# EAGLE design Lasermodul (EAGLE 7.3.0)
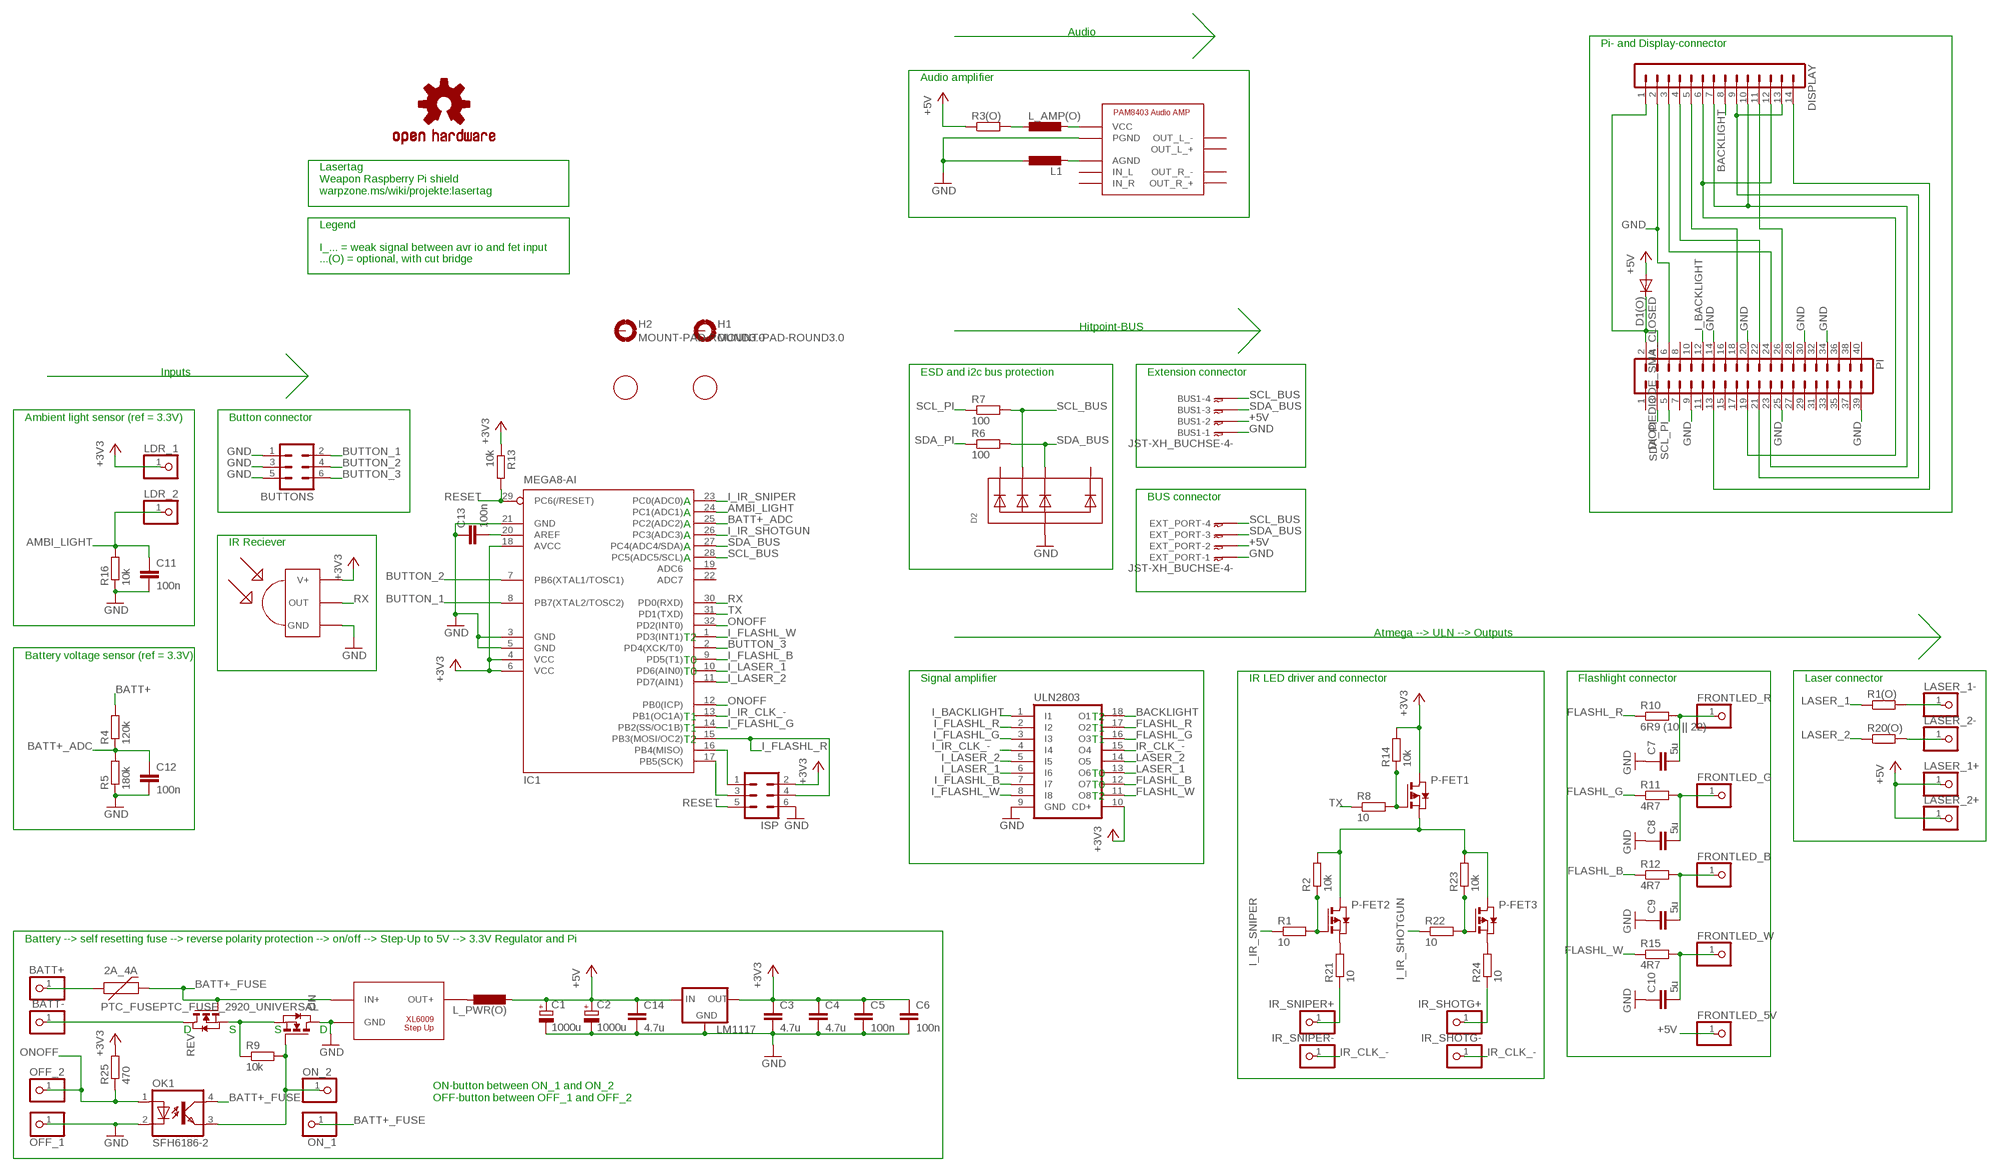
[diagram p0: schematic, sheet 1]

## Parts
2A_4A  PTC_FUSEPTC_FUSE_2920_UNIVERSAL  [PTC_FUSE_2920_UNIVERSAL]
BATT+  PIN-HEADER-1PIN-HEADER-1_BIG  [PIN-HEADER-1_BIG]
BATT-  PIN-HEADER-1PIN-HEADER-1_BIG  [PIN-HEADER-1_BIG]
BUS1  JST-XH_BUCHSE-4-  [JST-XH_BUCHSE-4]
BUTTONS  PIN-HEADER-3X2  [PIN-HEADER-3X2]
C1  1000u  C_EU_POL  [C_UNIVERSAL_PAD]
C2  1000u  C_EU_POL  [C_UNIVERSAL_PAD]
C3  4.7u  C_EU0805  [0805]
C4  4.7u  C_EU0805  [0805]
C5  100n  C_EU0603  [0603]
C6  100n  C_EU0603  [0603]
C7  5u  C_EU0805  [0805]
C8  5u  C_EU0805  [0805]
C9  5u  C_EU0805  [0805]
C10  5u  C_EU0805  [0805]
C11  100n  C_EU0603  [0603]
C12  100n  C_EU0603  [0603]
C13  100n  C_EU0603  [0603]
C14  4.7u  C_EU0805  [0805]
D1(O)  DIODEDIODE_SMA_CLOSED  [DIODE_SMA_CLOSED]
D2  ESD-SCHUTZ  [SOT363]
DISPLAY  PIN-HEADER-DISPLAY  [PIN-HEADER-DISPLAY]
EXT_PORT  JST-XH_BUCHSE-4-  [JST-XH_BUCHSE-4]
FRONTLED_5V  PIN-HEADER-1PIN-HEADER-1  [PIN-HEADER-1]
FRONTLED_B  PIN-HEADER-1PIN-HEADER-1  [PIN-HEADER-1]
FRONTLED_G  PIN-HEADER-1PIN-HEADER-1  [PIN-HEADER-1]
FRONTLED_R  PIN-HEADER-1PIN-HEADER-1  [PIN-HEADER-1]
FRONTLED_W  PIN-HEADER-1PIN-HEADER-1  [PIN-HEADER-1]
H1  MOUNT-PAD-ROUND3.0  [3,0-PAD]
H2  MOUNT-PAD-ROUND3.0  [3,0-PAD]
IC1  MEGA8-AI  [TQFP32-08]
IR_SHOTG+  PIN-HEADER-1PIN-HEADER-1  [PIN-HEADER-1]
IR_SHOTG-  PIN-HEADER-1PIN-HEADER-1  [PIN-HEADER-1]
IR_SNIPER+  PIN-HEADER-1PIN-HEADER-1  [PIN-HEADER-1]
IR_SNIPER-  PIN-HEADER-1PIN-HEADER-1  [PIN-HEADER-1]
ISP  PIN-HEADER-3X2  [PIN-HEADER-3X2]
L1  L-EUL2825P  [L2825P]
L_AMP(O)  L  [L_5MM_CLOSED]
L_PWR(O)  L  [L_5MM_CLOSED]
LASER_1+  PIN-HEADER-1PIN-HEADER-1  [PIN-HEADER-1]
LASER_1-  PIN-HEADER-1PIN-HEADER-1  [PIN-HEADER-1]
LASER_2+  PIN-HEADER-1PIN-HEADER-1  [PIN-HEADER-1]
LASER_2-  PIN-HEADER-1PIN-HEADER-1  [PIN-HEADER-1]
LDR_1  PIN-HEADER-1PIN-HEADER-1  [PIN-HEADER-1]
LDR_2  PIN-HEADER-1PIN-HEADER-1  [PIN-HEADER-1]
LM1117  LM1117_3V3_REGULATOR  [SOT223]
LOGO1  OSHW-LOGOM  [OSHW-LOGO-M]
OFF_1  PIN-HEADER-1PIN-HEADER-1  [PIN-HEADER-1]
OFF_2  PIN-HEADER-1PIN-HEADER-1  [PIN-HEADER-1]
OK1  SFH6186-2  [SMD4-7]
ON  N-MOSFET  [TO252]
ON_1  PIN-HEADER-1PIN-HEADER-1  [PIN-HEADER-1]
ON_2  PIN-HEADER-1PIN-HEADER-1  [PIN-HEADER-1]
P-FET1  PMOSSOT23  [SOT-23]
P-FET2  PMOSSOT23  [SOT-23]
P-FET3  PMOSSOT23  [SOT-23]
PI  PIN-HEADER-20X2  [PIN-HEADER-20X2]
R1  10  R_EU0603  [0603]
R1(O)  R_EU0603_CLOSED  [0603_CLOSED]
R2  10k  R_EU0603  [0603]
R3(O)  R_EU0805_CLOSED  [0805_CLOSED]
R4  120k  R_EU0603  [0603]
R5  180k  R_EU0603  [0603]
R6  100  R_EU0603  [0603]
R7  100  R_EU0603  [0603]
R8  10  R_EU0603  [0603]
R9  10k  R_EU0603  [0603]
R10  6R9 (10 || 22)  R_EU0603  [0603]
R11  4R7  R_EU0603  [0603]
R12  4R7  R_EU0603  [0603]
R13  10k  R_EU0603  [0603]
R14  10k  R_EU0603  [0603]
R15  4R7  R_EU0603  [0603]
R16  10k  R_EU0603  [0603]
R20(O)  R_EU0603_CLOSED  [0603_CLOSED]
R21  10  R_EU0603  [0603]
R22  10  R_EU0603  [0603]
R23  10k  R_EU0603  [0603]
R24  10  R_EU0603  [0603]
R25  470  R_EU0603  [0603]
REV  N-MOSFET  [TO252]
U$1  TSOP1838  [TSOP18XX]
U$3  XL6009-STEPUP-BOARD  [XL6009-STEPUP-BOARD]
U$4  PAM8403-AMP-BOARD  [PAM8403-AMP-BOARD]
U$5  FIDUCIAL  [FIDUCIAL_1MM]
U$6  FIDUCIAL  [FIDUCIAL_1MM]
ULN2803  ULN2803ASO18  [SO18W]

## Nets
+3V3: C3.1 C4.1 C5.1 C6.1 IC1.4(VCC) IC1.6(VCC) IC1.18(AVCC) ISP.2 LDR_1.1 LM1117.2(OUT) LM1117.4(OUT) P-FET1.1(D) R13.1 R14.2 R25.2 U$1.VCC(V+) ULN2803.10(CD+)
+5V: BUS1.P$2 C1.+ C2.+ C14.1 D1(O).A EXT_PORT.P$2 FRONTLED_5V.1 L_PWR(O).2 LASER_1+.1 LASER_2+.1 LM1117.3(IN) R3(O).1
AMBI_LIGHT: C11.1 IC1.24(PC1(ADC1)) LDR_2.1 R16.2
BACKLIGHT: DISPLAY.8 ULN2803.18(O1)
BATT+: 2A_4A.P$1 BATT+.1 R4.2
BATT+_ADC: C12.1 IC1.25(PC2(ADC2)) R4.1 R5.2
BATT+_FUSE: 2A_4A.P$2 OK1.4(COL) ON_1.1 REV.1(G) U$3.IN+
BATT-: BATT-.1 REV.3(D)
BUTTON_1: BUTTONS.2 IC1.8(PB7(XTAL2/TOSC2))
BUTTON_2: BUTTONS.4 IC1.7(PB6(XTAL1/TOSC1))
BUTTON_3: BUTTONS.6 IC1.2(PD4(XCK/T0))
EASTEREGG_NET: P-FET1.2(S) P-FET2.1(D) P-FET3.1(D) R2.2 R23.2
FLASHL_B: R12.1 ULN2803.12(O7)
FLASHL_G: R11.1 ULN2803.16(O3)
FLASHL_R: R10.1 ULN2803.17(O2)
FLASHL_W: R15.1 ULN2803.11(O8)
GND: BUS1.P$1 BUTTONS.1 BUTTONS.3 BUTTONS.5 C1.- C2.- C3.2 C4.2 C5.2 C6.2 C7.1 C8.1 C9.1 C10.1 C11.2 C12.2 C13.1 C14.2 D2.2(A) DISPLAY.2 EXT_PORT.P$1 IC1.3(GND) IC1.5(GND) IC1.21(GND) ISP.6 L1.1 LM1117.1(GND) OFF_1.1 OK1.2(C) ON.3(D) PI.6 PI.9 PI.14 PI.20 PI.25 PI.30 PI.34 PI.39 R5.1 R16.1 U$1.GND U$3.GND_IN(GND) U$3.GND_OUT(GND) U$4.PGND ULN2803.9(GND)
I_BACKLIGHT: PI.12 ULN2803.1(I1)
I_FLASHL_B: IC1.9(PD5(T1)) ULN2803.7(I7)
I_FLASHL_G: IC1.14(PB2(SS/OC1B)) ULN2803.3(I3)
I_FLASHL_R: IC1.15(PB3(MOSI/OC2)) ISP.4 ULN2803.2(I2)
I_FLASHL_W: IC1.1(PD3(INT1)) ULN2803.8(I8)
I_IR_CLK_-: IC1.13(PB1(OC1A)) ULN2803.4(I4)
I_IR_SHOTGUN: IC1.26(PC3(ADC3)) R22.1
I_IR_SNIPER: IC1.23(PC0(ADC0)) R1.1
I_LASER_1: IC1.10(PD6(AIN0)) ULN2803.6(I6)
I_LASER_2: IC1.11(PD7(AIN1)) ULN2803.5(I5)
IR_CLK_-: IR_SHOTG-.1 IR_SNIPER-.1 ULN2803.15(O4)
IR_SHOTGUN_TX_+: IR_SHOTG+.1 R24.1
IR_SNIPER_TX_+: IR_SNIPER+.1 R21.1
LASER_1: R1(O).1 ULN2803.13(O6)
LASER_1-: LASER_1-.1 R1(O).2
LASER_2: R20(O).1 ULN2803.14(O5)
LASER_2-: LASER_2-.1 R20(O).2
LCD_CS: DISPLAY.3 PI.24
LCD_DC: DISPLAY.5 PI.18
LCD_MISO: DISPLAY.9 DISPLAY.13 PI.21
LCD_MOSI: DISPLAY.6 DISPLAY.12 PI.19
LCD_RESET: DISPLAY.4 PI.22
LCD_SCK: DISPLAY.7 DISPLAY.10 PI.23
LCD_TOUCH_CS: DISPLAY.11 PI.26
LCD_TOUCH_IRQ: DISPLAY.14 PI.13
N$5: L1.2 U$4.AGND
N$11: IC1.16(PB4(MISO)) ISP.1
N$13: IC1.17(PB5(SCK)) ISP.3
N$15: C7.2 FRONTLED_R.1 R10.2
N$16: P-FET1.3(G) R8.2 R14.1
N$18: C13.2 IC1.20(AREF)
N$20: P-FET2.3(G) R1.2 R2.1
N$21: C8.2 FRONTLED_G.1 R11.2
N$22: C9.2 FRONTLED_B.1 R12.2
N$23: C10.2 FRONTLED_W.1 R15.2
N$27: L_PWR(O).1 U$3.OUT+
N$28: ON.2(S) R9.1 REV.2(S)
N$34: P-FET2.2(S) R21.2
N$44: D1(O).C DISPLAY.1 PI.2 PI.4
N$45: L_AMP(O).2 R3(O).2
N$46: L_AMP(O).1 U$4.VCC
N$53: P-FET3.2(S) R24.2
N$55: P-FET3.3(G) R22.2 R23.1
ONOFF: IC1.12(PB0(ICP)) IC1.32(PD2(INT0)) OFF_2.1 OK1.1(A) R25.1
ONOFF_2: OK1.3(EMIT) ON.1(G) ON_2.1 R9.2
RESET: IC1.29(PC6(/RESET)) ISP.5 R13.2
RX: IC1.30(PD0(RXD)) U$1.OUT
SCL_BUS: BUS1.P$4 D2.3(C2) EXT_PORT.P$4 IC1.28(PC5(ADC5/SCL)) R7.2
SCL_PI: PI.5 R7.1
SDA_BUS: BUS1.P$3 D2.4(C3) EXT_PORT.P$3 IC1.27(PC4(ADC4/SDA)) R6.2
SDA_PI: PI.3 R6.1
TX: IC1.31(PD1(TXD)) R8.1
Unconnected: D2.1(C1) D2.6(C5) H1.B3,0(MOUNT) H2.B3,0(MOUNT) IC1.19(ADC6) IC1.22(ADC7) PI.1 PI.7 PI.8 PI.10 PI.11 PI.15 PI.16 PI.17 PI.27 PI.28 PI.29 PI.31 PI.32 PI.33 PI.35 PI.36 PI.37 PI.38 PI.40 U$4.IN_L U$4.IN_R U$4.OUT_L_+ U$4.OUT_L_- U$4.OUT_R_+ U$4.OUT_R_-

## Notes on the sheet
- Audio
- Pi- and Display-connector
- Audio amplifier
- Lasertag
  Weapon Raspberry Pi shield
  warpzone.ms/wiki/projekte:lasertag
- Legend
- I_... = weak signal between avr io and fet input
- ...(O) = optional, with cut bridge
- Hitpoint-BUS
- Inputs | ESD and i2c bus protection | Extension connector
- Ambient light sensor (ref = 3.3V) | Button connector
- BUS connector
- A
- A
- A
- A
- IR Reciever
- A
- A
- Atmega --> ULN --> Outputs
- T2
- Battery voltage sensor (ref = 3.3V)
- T0
- T0
- Signal amplifier | IR LED driver and connector | Flashlight connector | Laser connector
- T1 | T2
- T1 | T1
- T2 | T1
- T0
- T0
- T2
- Battery --> self resetting fuse --> reverse polarity protection --> on/off --> Step-Up to 5V --> 3.3V Regulator and Pi
- D | S | S | D
- ON-button between ON_1 and ON_2
  OFF-button between OFF_1 and OFF_2

## Library data of the parts
2A_4A = wz:PTC_FUSE: PTC Resettable Fuse
BATT+ BATT- FRONTLED_5V FRONTLED_B FRONTLED_G FRONTLED_R FRONTLED_W IR_SHOTG+ IR_SHOTG- IR_SNIPER+ IR_SNIPER- LASER_1+ LASER_1- LASER_2+ LASER_2- LDR_1 LDR_2 OFF_1 OFF_2 ON_1 ON_2 = wz:PIN-HEADER-1: PIN HEADER
BUS1 EXT_PORT = wz:JST-XH_BUCHSE-4: JST CONNECTOR
BUTTONS ISP = wz:PIN-HEADER-3X2: PIN HEADER; OC_FARNELL: unknown; OC_NEWARK: unknown
C1 C2 = wz:C_EU_POL: CAPACITOR, European symbol
C3-C14 = wz:C_EU: CAPACITOR, European symbol
D1(O) = wz:DIODE: DIODE super fast rectifier, 2 A
D2 = wz:ESD-SCHUTZ: Voltage Transient Suppressor Array SOT363 SMF05C - 100W 5V: Digikey - SMF05CT1GOSCT-ND
DISPLAY = wz:PIN-HEADER-DISPLAY: PIN HEADER; OC_FARNELL: unknown; OC_NEWARK: unknown
H1 H2 = holes:MOUNT-PAD-ROUND: MOUNTING PAD, round
IC1 = atmel:MEGA8: MICROCONTROLLER 8 Kbytes FLASH, 1 kbytes SRAM, 512 bytes EEPROM, USART, 6-channel 10 bit ADC, 2-channel 8 bit ADC Pin compatible with Atmega48, ATMega88, ATMega168 Source: avr.lbr; MPN: ATMEGA8-16AU; OC_FARNELL: 9171371; OC_NEWARK: 73M8863
L1 = rcl:L-EU: INDUCTOR, European symbol
L_AMP(O) L_PWR(O) = wz:L
LM1117 = wz:LM1117_3V3_REGULATOR: 1117
LOGO1 = SparkFun-Aesthetics:OSHW-LOGO: Open Source Hardware Logo This logo indicates the piece of hardware it is found on incorporates a OSHW license and/or adheres to the definition of open source hardware found here: http://freedomdefined.org/OSHW
OK1 = optocoupler:SFH618?*: Optocoupler, Phototransistor Output, Low Input Current Source: Data sheet <http://www.vishay.com/docs/83673/sfh618.pdf>; MF: VISHAY/TELEFUNKEN; MPN: SFH6186-2; OC_FARNELL: 1469583; OC_NEWARK: 58K2210
ON REV = wz:N-MOSFET: MOS FET
P-FET1-P-FET3 = zetex:PMOSSOT23: MOS FET; OC_FARNELL: unknown; OC_NEWARK: unknown
PI = wz:PIN-HEADER-20X2: PIN HEADER; OC_FARNELL: unknown; OC_NEWARK: unknown
R1 R1(O) R2 R3(O) R4-R16 R20(O) R21-R25 = wz:R_EU: RESISTOR, European symbol
U$1 = tsop:TSOP1838: IR Receiver and Demodulator
U$3 = wz:XL6009-STEPUP-BOARD
U$4 = wz:PAM8403-AMP-BOARD
U$5 U$6 = adafruit:FIDUCIAL: For use by pick and place machines to calibrate the vision/machine, 1mm By microbuilder.eu
ULN2803 = wz:ULN2803A: DRIVER ARRAY

## Net classes
0 default: width 0.016 mm

## Board
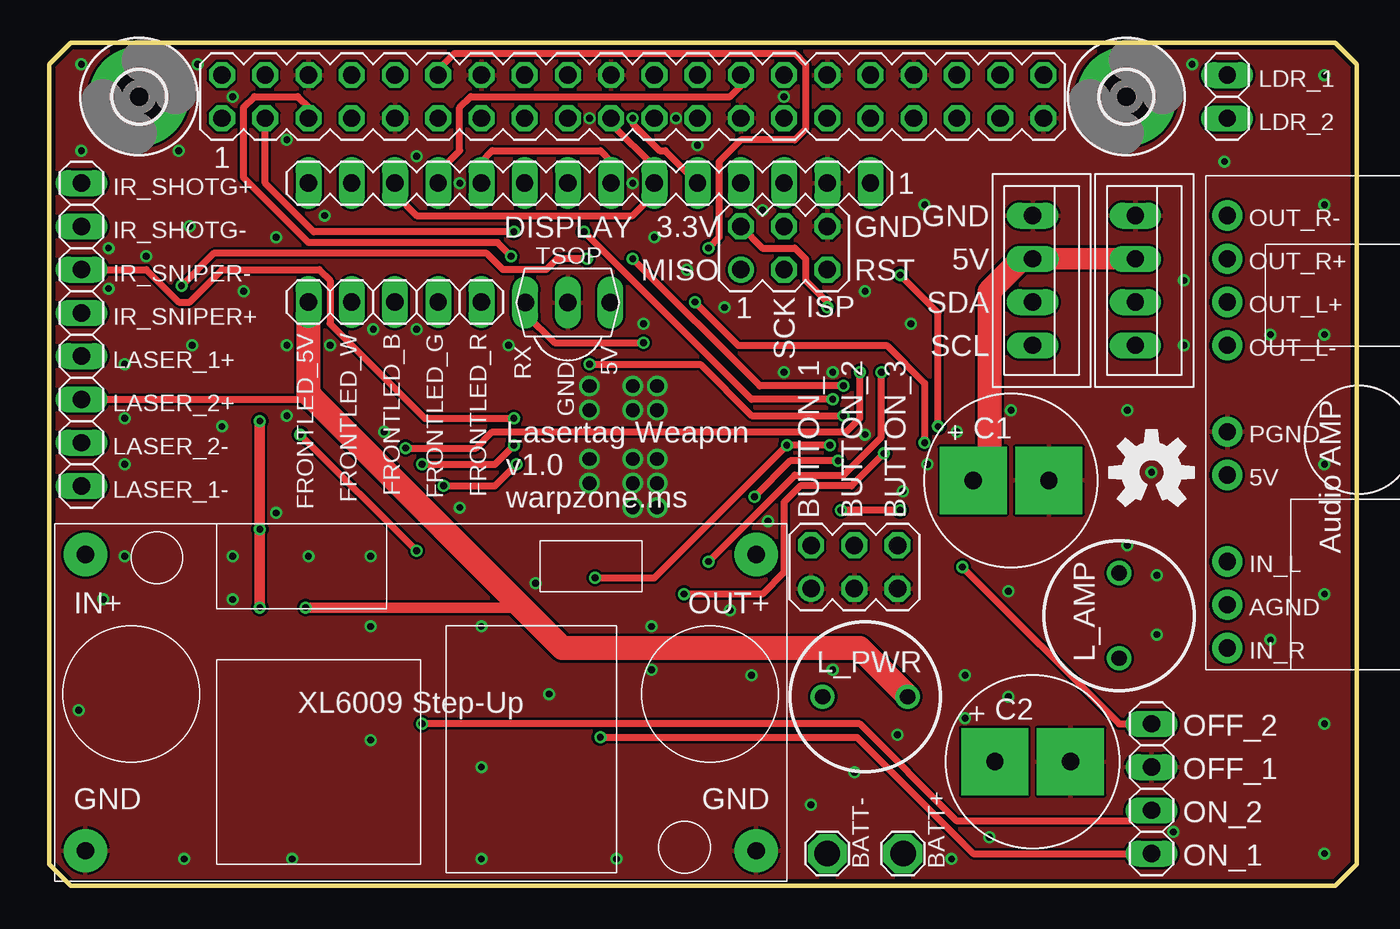
[diagram p1: board, top side]
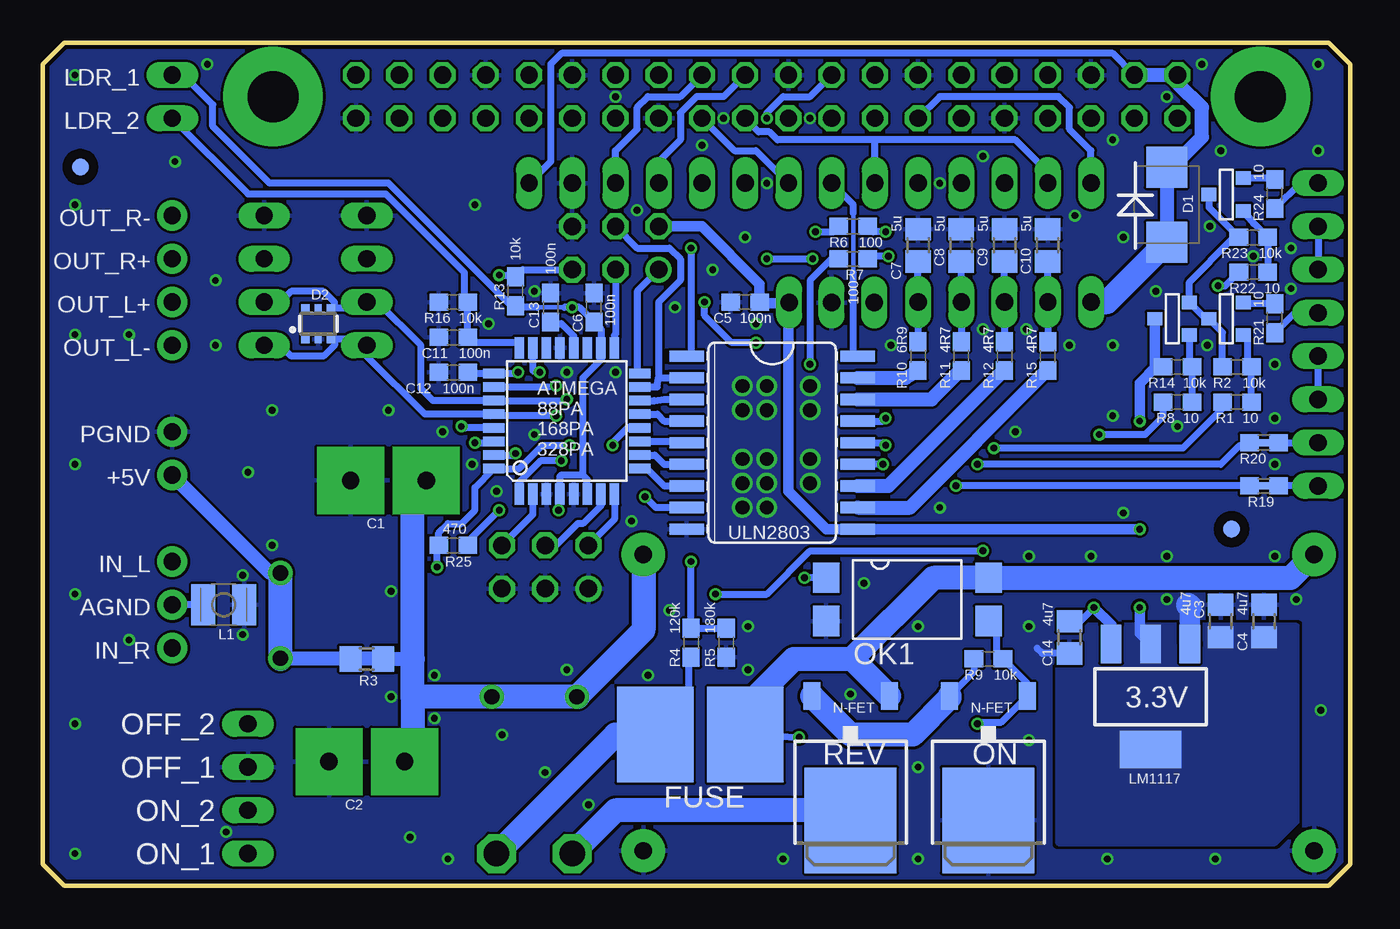
[diagram p2: board, bottom side, seen from below]

Size 76.83 x 49.53 mm. Coordinates in mm from the lower left corner, seen from the top.
Outline: 0,1.27 0,48.26 1.27,49.53 75.56,49.53 76.83,48.26 76.83,1.27 75.56,0 1.27,0 0,1.27
Copper layers (1*16): Top 0.035mm / dielectric 1.5mm / Bottom 0.035mm
Design rules "ITEADstudio_DRC *": minimum track width 6mil, minimum drill 12mil, track to track 6mil, track to pad 6mil, pad to pad 6mil, via to via 6mil, smd to smd 0mil, copper to edge 10mil, drill to drill 10mil, minimum pad ring 10mil, minimum via ring 6mil, stop-mask expansion 2mil, vias tented up to drill 100mil, thermal gap 6mil

### Footprints (pad centres in the part's own frame; a part is rotated, then mirrored left to right if it is on the bottom)
PTC_FUSE_2920_UNIVERSAL = smd 4.5 x 5.6: P$1 1.07,0; P$2 6.365,0
PIN-HEADER-1_BIG = drill 1.5 pad 2.286 octagon: 1 0,0
JST-XH_BUCHSE-4 = drill 1.016 pad 1.321 long: P$1 -3.81,0; P$2 -1.27,0; P$3 1.27,0; P$4 3.81,0
PIN-HEADER-3X2 = drill 1.016: 1 -2.54,-1.27 | drill 1.016 octagon: 2 -2.54,1.27; 3 0,-1.27; 4 0,1.27; 5 2.54,-1.27; 6 2.54,1.27
C_UNIVERSAL_PAD = drill 1.016 pad 3.937 square: + -2.223,0; - 2.223,0
0805 = smd 1.3 x 1.5: 1 -0.95,0; 2 0.95,0
0603 = smd 1.1 x 1: 1 -0.85,0; 2 0.85,0
DIODE_SMA_CLOSED = smd 2.4 x 2.4: A 2.2,0; C -2.2,0
SOT363 = smd 0.5 x 0.5: 1 -0.75,-0.9; 3 0.75,-0.9; 4 0.75,0.9; 6 -0.75,0.9 | smd 0.4 x 0.5: 2 0,-0.9; 5 0,0.9
PIN-HEADER-DISPLAY = drill 1.016 long: 1 -16.51,0; 2 -13.97,0; 3 -11.43,0; 4 -8.89,0; 5 -6.35,0; 6 -3.81,0; 7 -1.27,0; 8 1.27,0; 9 3.81,0; 10 6.35,0; 11 8.89,0; 12 11.43,0; 13 13.97,0; 14 16.51,0
PIN-HEADER-1 = drill 1.016 pad 1.321 long: 1 0,0
3,0-PAD = drill 3 pad 5.842: B3,0 0,0
TQFP32-08 = smd 1.27 x 0.559: 1 -4.293,2.8; 2 -4.293,2; 3 -4.293,1.2; 4 -4.293,0.4; 5 -4.293,-0.4; 6 -4.293,-1.2; 7 -4.293,-2; 8 -4.293,-2.8; 17 4.293,-2.8; 18 4.293,-2; 19 4.293,-1.2; 20 4.293,-0.4; 21 4.293,0.4; 22 4.293,1.2; 23 4.293,2; 24 4.293,2.8 | smd 0.559 x 1.27: 9 -2.8,-4.293; 10 -2,-4.293; 11 -1.2,-4.293; 12 -0.4,-4.293; 13 0.4,-4.293; 14 1.2,-4.293; 15 2,-4.293; 16 2.8,-4.293; 25 2.8,4.293; 26 2,4.293; 27 1.2,4.293; 28 0.4,4.293; 29 -0.4,4.293; 30 -1.2,4.293; 31 -2,4.293; 32 -2.8,4.293
L2825P = smd 1.4 x 2.4: 1 -1.2,0; 2 1.2,0
L_5MM_CLOSED = drill 0.9 pad 1.422: 1 -2.5,0; 2 2.5,0
SOT223 = smd 1.219 x 2.235: 1 -2.311,-3.099; 2 0,-3.099; 3 2.311,-3.099 | smd 3.6 x 2.2: 4 0,3.099
SMD4-7 = smd 1.78 x 1.55: 1 -1.27,-4.77; 2 1.27,-4.77; 3 1.27,4.77; 4 -1.27,4.77
TO252 = smd 1 x 1.6: 1 -2.28,-4.8; 2 2.28,-4.8 | smd 5.4 x 6.2: 3 0,2.5
SOT-23 = smd 0.787 x 0.889: 1 0.025,-1.016; 2 -0.94,1.016; 3 0.991,1.016
PIN-HEADER-20X2 = drill 1.016 octagon: 1 -24.13,-1.27; 2 -24.13,1.27; 3 -21.59,-1.27; 4 -21.59,1.27; 5 -19.05,-1.27; 6 -19.05,1.27; 7 -16.51,-1.27; 8 -16.51,1.27; 9 -13.97,-1.27; 10 -13.97,1.27; 11 -11.43,-1.27; 12 -11.43,1.27; 13 -8.89,-1.27; 14 -8.89,1.27; 15 -6.35,-1.27; 16 -6.35,1.27; 17 -3.81,-1.27; 18 -3.81,1.27; 19 -1.27,-1.27; 20 -1.27,1.27; 21 1.27,-1.27; 22 1.27,1.27; 23 3.81,-1.27; 24 3.81,1.27; 25 6.35,-1.27; 26 6.35,1.27; 27 8.89,-1.27; 28 8.89,1.27; 29 11.43,-1.27; 30 11.43,1.27; 31 13.97,-1.27; 32 13.97,1.27; 33 16.51,-1.27; 34 16.51,1.27; 35 19.05,-1.27; 36 19.05,1.27; 37 21.59,-1.27; 38 21.59,1.27; 39 24.13,-1.27; 40 24.13,1.27
0603_CLOSED = smd 1.1 x 1: 1 -0.85,0; 2 0.85,0 | smd 1.016 x 0.406: BRIDGE 0,0
0805_CLOSED = smd 1.3 x 1.5: 1 -0.95,0; 2 0.95,0
TSOP18XX = drill 1.016 pad 1.321 long: GND -0.001,-0.027; OUT -2.501,-0.027; VCC 2.499,-0.027
XL6009-STEPUP-BOARD = drill 1.016 pad 2.54: GND_IN 41.2,19.2; GND_OUT 1.8,19.2; IN+ 41.2,1.8; OUT+ 1.8,1.8
PAM8403-AMP-BOARD = drill 1.016 pad 1.778: AGND 3.81,-1.27; IN_L 6.35,-1.27; IN_R 1.27,-1.27; OUT_L_+ 21.59,-1.27; OUT_L_- 19.05,-1.27; OUT_R_+ 24.13,-1.27; OUT_R_- 26.67,-1.27; PGND 13.97,-1.27; VCC 11.43,-1.27
FIDUCIAL_1MM = smd 1 x 1: 1 0,0
SO18W = smd 0.66 x 2.032: 1 -5.08,-5.029; 2 -3.81,-5.029; 3 -2.54,-5.029; 4 -1.27,-5.029; 5 0,-5.029; 6 1.27,-5.029; 7 2.54,-5.029; 8 3.81,-5.029; 9 5.08,-5.029; 10 5.08,5.029; 11 3.81,5.029; 12 2.54,5.029; 13 1.27,5.029; 14 0,5.029; 15 -1.27,5.029; 16 -2.54,5.029; 17 -3.81,5.029; 18 -5.08,5.029

### Placement (x,y rotation side)
2A_4A  41.91,8.89 0 bottom
BATT+  50.16,1.91 0 top
BATT-  45.72,1.91 180 top
BUS1  57.78,35.56 270 top
BUTTONS  47.31,18.73 0 top
C1  56.52,23.81 0 top
C2  57.78,7.3 0 top
C3  7.62,15.56 90 bottom
C4  5.08,15.56 90 bottom
C5  35.56,34.29 180 bottom
C6  44.45,33.97 90 bottom
C7  25.4,37.62 270 bottom
C8  22.86,37.62 270 bottom
C9  20.32,37.62 270 bottom
C10  17.78,37.62 270 bottom
C11  52.7,32.23 180 bottom
C12  52.7,30.16 180 bottom
C13  46.99,33.97 270 bottom
C14  16.51,14.61 270 bottom
D1(O)  10.79,40.01 270 bottom
D2  60.64,33.02 0 bottom
DISPLAY  31.75,41.27 180 top
EXT_PORT  63.82,35.56 270 top
FRONTLED_5V  15.24,34.29 180 top
FRONTLED_B  20.32,34.29 0 top
FRONTLED_G  22.86,34.29 180 top
FRONTLED_R  25.4,34.29 180 top
FRONTLED_W  17.78,34.29 180 top
H1  63.29,46.35 0 top
H2  5.29,46.35 0 top
IC1  46.04,27.3 90 bottom
IR_SHOTG+  1.91,41.27 270 top
IR_SHOTG-  1.91,38.73 270 top
IR_SNIPER+  1.91,33.66 270 top
IR_SNIPER-  1.91,36.2 270 top
ISP  43.18,37.47 0 top
L1  66.2,16.51 180 bottom
L_AMP(O)  62.87,15.88 270 top
L_PWR(O)  47.94,11.11 0 top
LASER_1+  1.91,31.11 270 top
LASER_1-  1.91,23.5 270 top
LASER_2+  1.91,28.57 270 top
LASER_2-  1.91,26.04 270 top
LDR_1  69.22,47.62 270 top
LDR_2  69.22,45.09 270 top
LM1117  11.75,11.11 180 bottom
LOGO1  64.77,24.29 0 top
OFF_1  64.77,6.99 270 top
OFF_2  64.77,9.53 270 top
OK1  26.04,16.83 270 bottom
ON  21.27,6.35 180 bottom
ON_1  64.77,1.91 270 top
ON_2  64.77,4.45 270 top
P-FET1  10.48,33.34 270 bottom
P-FET2  7.3,33.34 270 bottom
P-FET3  7.3,40.64 270 bottom
PI  34.29,46.35 0 top
R1  6.67,28.42 0 bottom
R1(O)  5.08,23.5 0 bottom
R2  6.67,30.48 180 bottom
R3(O)  57.78,13.34 180 bottom
R4  38.73,14.29 270 bottom
R5  36.67,14.29 90 bottom
R6  29.21,38.73 180 bottom
R7  29.21,36.83 180 bottom
R8  10.16,28.42 0 bottom
R9  21.27,13.34 0 bottom
R10  25.4,31.11 90 bottom
R11  22.86,31.11 90 bottom
R12  20.32,31.11 90 bottom
R13  49.05,34.92 90 bottom
R14  10.16,30.48 180 bottom
R15  17.78,31.11 90 bottom
R16  52.7,34.29 0 bottom
R20(O)  5.08,26.04 0 bottom
R21  4.45,33.34 90 bottom
R22  5.71,36.04 0 bottom
R23  5.71,38.1 180 bottom
R24  4.45,40.64 90 bottom
R25  52.7,20 0 bottom
REV  29.37,6.35 180 bottom
U$1  30.48,34.29 0 top
U$2  [PI2]  148.59,49.53 0 top  (outside the outline)
U$3  43.34,21.27 180 top
U$4  67.94,12.7 90 top
U$5  74.61,42.23 0 bottom
U$6  6.99,20.95 0 bottom
ULN2803  33.97,26.04 270 bottom

### Tracks (layer width: path | path; a pad name or v marks a point on that pad's centre or on a via)
+3V3  (via drill 0.4)
  Top 0.406: ISP.2 41.91,37.47 43.81,37.47 44.45,36.83 44.45,35.56 45.72,34.29 v45.72,33.97 | v50.01,22.07 v46.51,22.07
  Top 0.61: v12.38,27.3 v12.38,20.95 v12.38,16.35
  Bottom 0.254: 46.2,33.97 47.78,33.97
  Bottom 0.406: 11.49,30.31 R14.2 | 48.79,33.97 R13.1 | R13.1 49.31,34.08 56.52,41.27 63.5,41.27 66.83,44.61 66.83,45.88 68.58,47.62 LDR_1.1 | IC1.6 44.84,23.88 45.09,24.13 | 45.09,24.13 46.35,24.13 46.44,24.05 IC1.4 46.51,22.94 v46.51,22.07 | 45.09,24.13 45.09,29.84 44.04,30.89 IC1.18 44.04,32.71 C6.1 45.3,33.97 v45.72,33.97 46.2,33.97 | R25.2 51.85,20.22 v50.01,22.07 | 47.78,33.97 48.95,33.97 R13.1
  Bottom 0.61: P-FET1.1 11.49,30.31 | R14.2 11.43,30.48 12.38,29.53 v12.38,27.3 | v12.38,16.35 12.38,14.85 LM1117.2 | v12.38,20.95 ULN2803.10 30.8,20.95 33.02,23.18 33.02,34.22 | 33.02,34.22 U$1.VCC | 33.02,34.22 34.64,34.22 C5.1 34.71,35.34 38.1,38.73 ISP.2
  pour Bottom (no thermals): 3.17,15.24 17.14,15.24 17.14,2.54 4.45,2.54 3.17,3.81
+5V  (via drill 0.4)
  Top 0.406: 15.4,28.73 15.24,28.57 LASER_2+.1
  Top 0.61: 27.62,16.51 27.78,16.35 v15.08,16.35
  Top 1.27: EXT_PORT.P$2 BUS1.P$2
  Top 1.422: BUS1.P$2 57.15,36.83 55.24,34.92 55.24,25.08 C1.+ | L_PWR(O).2 50.44,11.15 47.62,13.97 30.16,13.97 27.78,16.35 15.4,28.73 15.24,28.89 FRONTLED_5V.1
  Bottom 0.406: LASER_2+.1 LASER_1+.1 | C14.1 15.88,15.55 v15.08,16.35
  Bottom 0.61: LM1117.3 14.06,15.33 v15.08,16.35
  Bottom 0.813: R3(O).1 55.09,13.34
  Bottom 1.422: FRONTLED_5V.1 14.31,34.29 D1(O).A | 55.09,10.95 55.09,13.34 55.09,22.7 C1.+ | L_PWR(O).2 54.93,11.11 55.09,10.95 | 55.09,10.95 55.09,7.46 C2.+
AMBI_LIGHT
  Bottom 0.406: IC1.24 48.83,31.91 51.44,31.91 51.75,32.23 C11.1 R16.2 | R16.2 51.85,34.23 | LDR_2.1 64.77,40.64 56.67,40.64 52.07,36.04 52.07,34.35 R16.2
BACKLIGHT
  Bottom 0.254: 29.21,36.04 29.21,39.53
  Bottom 0.406: 28.89,31.17 ULN2803.18 | DISPLAY.8 29.21,40.01 29.21,39.53 | 28.57,31.11 ULN2803.18 | ULN2803.18 29.21,31.11 29.21,36.04
BATT+
  Bottom 0.406: R4.2 38.73,13.34 38.89,13.02 38.89,10.68 2A_4A.P$1
  Bottom 1.422: BATT+.1 43.18,8.89 2A_4A.P$1
BATT+_ADC  (via drill 0.4)
  Top 0.406: v38.73,19.05 43.81,24.13 46.67,24.13 48.9,26.35 v48.9,30.16
  Bottom 0.406: R5.2 R4.1 v38.73,19.05 | C12.1 52.12,30.11 IC1.25 49.16,30.11 v48.9,30.16
BATT+_FUSE  (via drill 0.4)
  Top 0.406: v32.38,8.73 47.47,8.73 54.29,1.91 ON_1.1
  Bottom 0.406: REV.1 27.18,11.15 | 2A_4A.P$2 v32.38,8.73
  Bottom 1.422: 2A_4A.P$2 35.55,10.49 32.7,13.34 29.27,13.34 | 29.27,13.34 REV.1 | 29.27,13.34 24.51,18.1 OK1.4 3.51,18.1 U$3.IN+
BATT-
  Bottom 0.406: REV.3 30.04,3.85 30.64,4.45
  Bottom 1.422: 30.64,4.45 43.18,4.45 BATT-.1
BUTTON_1
  Bottom 0.406: IC1.8 43.24,21.53 BUTTONS.2
BUTTON_2
  Bottom 0.406: IC1.7 44.04,22.32 45.09,21.27 45.4,21.27 46.67,20 BUTTONS.4
BUTTON_3
  Bottom 0.406: IC1.2 48.04,21.81 BUTTONS.6
EASTEREGG_NET
  Bottom 0.406: R2.2 7.52,32.51 P-FET2.1 8.5,33.31 P-FET1.2 9.46,35.47 6.99,37.94 6.83,38 R23.2 8.32,39.85 P-FET3.1
FLASHL_B
  Bottom 0.813: ULN2803.12 27.15,23.5 20.48,30.16 R12.1
FLASHL_G
  Bottom 0.813: ULN2803.16 24.61,28.57 23.02,30.16 R11.1
FLASHL_R
  Bottom 0.813: ULN2803.17 26.14,29.84 R10.1
FLASHL_W
  Bottom 0.813: ULN2803.11 25.88,22.23 17.94,30.16 R15.1
GND  (via drill 0.4, 0.8)
  Bottom 0.406: C14.2 18.1,13.65 18.41,13.97
  Bottom 1.21: LM1117.1 9.44,16.42
  Bottom 1.422: 9.44,16.42 9.53,16.51
  other vias: 43.18,46.35 36.83,45.09 46.04,30.16 47.94,34.92 35.72,25.08 34.29,25.08 34.29,23.65 35.72,23.65 35.72,22.23 34.29,22.23 31.75,23.65 31.75,25.08 31.75,29.37 31.75,27.94 34.29,27.94 34.29,29.37 35.72,29.37 35.72,27.94 10.79,46.35 13.97,43.81 21.59,42.86 1.91,43.18 7.62,43.18 8.26,38.73 13.34,38.1 11.43,34.92 16.51,31.75 19.05,32.7 16.19,39.37 5.71,36.99 3.49,35.08 4.45,30.64 4.45,27.46 4.45,24.77 4.45,19.37 3.17,16.83 10.79,16.83 10.79,19.37 10.16,26.99 13.97,31.75 18.89,15.24 18.89,19.37 1.75,10.32 7.94,1.59 14.29,1.59 18.89,8.57 25.4,6.99 25.4,1.59 33.34,1.59 47.31,6.67 44.77,4.76 53.02,1.59 53.82,9.84 53.82,12.38 56.36,11.11 66.04,3.17 65.09,18.26 65.09,14.76 63.34,20 64.77,24.29 63.34,27.94 66.67,31.75 66.67,35.56 50.64,33.02 69.06,42.55 67.15,48.26 34.29,41.27 24.13,41.27 38.1,43.5 41.91,39.69 35.56,38.1 37.47,36.2 39.69,33.97 26.99,31.75 24.13,22.23 28.57,17.78 25.4,15.24 35.4,12.7 35.4,15.24 56.36,17.3 56.52,27.94 71.75,14.45 71.75,32.38 8.73,48.26 43.18,30.16 34.92,33.02 51.44,40.01 13.97,27.62 31.75,45.09 13.34,21.91 55.24,2.86 19.68,26.67 21.59,32.7 8.41,31.75 3.49,37.47 1.91,48.26 74.93,47.62 74.93,1.91 29.37,11.27 41.27,12.38 40.01,16.19 50.16,23.18 53.34,26.67 47.94,26.51 51.59,24.77 15.24,19.37 46.04,12.7 49.85,8.89 42.23,21.43 74.93,9.53 74.93,17.14 74.93,24.77 74.93,32.38 74.93,40.01
  pour Bottom (rank 2): 0,48.26 1.27,49.53 75.56,49.53 76.83,48.26 76.83,1.27 75.56,0 1.27,0 0,1.27
  pour Top (rank 2): 0,48.26 1.27,49.53 75.56,49.53 76.83,48.26 76.83,1.27 75.56,0 1.27,0 0,1.27
I_BACKLIGHT  (via drill 0.4)
  Top 0.406: PI.12 22.86,47.94 23.81,48.9 43.81,48.9 44.45,48.26 44.45,44.45 43.81,43.81 40.64,43.81 39.37,42.55 39.37,38.1 v38.73,37.47
  Bottom 0.406: 39.05,31.17 ULN2803.1 38.73,31.38 v38.73,37.47
I_FLASHL_B
  Bottom 0.406: IC1.9 41.33,24.5 40.32,23.5 ULN2803.7
I_FLASHL_G
  Bottom 0.406: IC1.14 40.89,28.5 40.32,28.57 ULN2803.3
I_FLASHL_R
  Bottom 0.406: IC1.15 40.73,29.3 40.64,29.84 | 40.64,29.84 ULN2803.2 | ISP.4 41.91,37.47 40.01,37.47 39.37,36.83 39.37,35.56 40.64,34.29 40.64,29.84
I_FLASHL_W  (via drill 0.4)
  Top 0.406: v46.35,24.96 43.54,24.96 v41.43,22.86
  Bottom 0.406: IC1.1 48.84,23.71 47.58,24.96 v46.35,24.96 | ULN2803.8 40.8,22.23 v41.43,22.86
I_IR_CLK_-
  Bottom 0.406: IC1.13 40.72,27.7 40.32,27.3 ULN2803.4
I_IR_SHOTGUN  (via drill 0.4)
  Top 0.406: v46.67,29.37 41.75,29.37 v34.29,36.83 | v31.59,36.83 29.84,36.83 29.21,36.2 26.67,36.2 25.72,37.15 9.68,37.15 v7.78,35.24
  Bottom 0.406: IC1.26 47.09,29.3 v46.67,29.37 | v34.29,36.83 v31.59,36.83 | v7.78,35.24 7.36,35.24 R22.1
I_IR_SNIPER  (via drill 0.4)
  Top 0.406: v20.95,25.72 25.08,25.72 26.04,26.67 46.83,26.67 47.62,27.46 v47.62,30.16
  Bottom 0.406: R1.1 7.46,28.1 9.84,25.72 v20.95,25.72 | IC1.23 48.04,30.26 v47.62,30.16
I_LASER_1
  Bottom 0.406: IC1.10 40.86,25.3 40.32,24.77 ULN2803.6
I_LASER_2
  Bottom 0.406: IC1.11 39.07,26.11 ULN2803.5
IR_CLK_-  (via drill 0.4)
  Top 0.406: IR_SNIPER-.1 5.71,36.2 7.62,34.29 8.26,34.29 10.16,36.2 15.88,36.2 16.51,35.56 16.51,33.02 22.07,27.46 v27.3,27.46
  Bottom 0.406: IR_SHOTG-.1 IR_SNIPER-.1 | ULN2803.15 27.46,27.3 v27.3,27.46
IR_SHOTGUN_TX_+
  Bottom 0.406: IR_SHOTG+.1 2.96,41.27 R24.1
IR_SNIPER_TX_+
  Bottom 0.406: 4.5,32.65 R21.1 3.28,33.66 IR_SNIPER+.1
LASER_1  (via drill 0.4)
  Top 0.406: v23.18,23.5 26.19,23.5 v27.46,24.77
  Bottom 0.406: R1(O).1 v23.18,23.5 | v27.46,24.77 ULN2803.13
LASER_1-
  Bottom 0.406: LASER_1-.1 R1(O).2
LASER_2  (via drill 0.4)
  Top 0.406: v21.91,24.77 26.19,24.77 v27.3,25.88
  Bottom 0.406: R20(O).1 6.57,25.82 7.62,24.77 v21.91,24.77 | ULN2803.14 27.46,26.04 v27.3,25.88
LASER_2-
  Bottom 0.406: R20(O).2 LASER_2-.1
LCD_CS
  Bottom 0.406: DISPLAY.3 43.18,43.18 41.91,44.45 41.91,45.72 41.27,46.35 39.37,46.35 PI.24
LCD_DC  (via drill 0.4)
  Top 0.406: v34.29,45.09 34.29,44.77 35.88,43.18 36.2,43.18 DISPLAY.5
  Bottom 0.406: v34.29,45.09 34.29,45.4 33.34,46.35 31.75,46.35 PI.18
LCD_MISO
  Bottom 0.406: DISPLAY.9 27.94,43.81 | PI.21 34.77,44.29 34.13,44.29 33.66,43.81 27.94,43.81 | DISPLAY.13 17.78,41.91 19.68,43.81 27.94,43.81
LCD_MOSI
  Top 0.406: DISPLAY.12 20.32,40.64 21.59,39.37 34.29,39.37 35.56,40.64 DISPLAY.6 35.56,42.23 33.02,44.77 PI.19
LCD_RESET
  Bottom 0.406: PI.22 36.83,46.35 38.42,46.35 39.37,45.4 39.37,43.81 40.64,42.55 DISPLAY.4
LCD_SCK
  Top 0.406: DISPLAY.10 25.4,42.55 26.04,43.18 32.38,43.18 33.02,42.55 DISPLAY.7
  Bottom 0.406: PI.23 36.2,43.18 34.92,43.18 DISPLAY.7
LCD_TOUCH_CS
  Top 0.406: DISPLAY.11 22.86,41.91 24.13,43.18 24.13,45.72 24.77,46.35 40.01,46.35 40.64,46.99 PI.26
LCD_TOUCH_IRQ
  Bottom 0.406: DISPLAY.14 15.24,43.18 16.51,44.45 16.51,45.72 17.14,46.35 24.13,46.35 PI.13
N$5
  Bottom 0.406: L1.2 U$4.AGND
N$11
  Bottom 0.406: IC1.16 42.01,30.16 41.91,30.16 41.91,34.92 ISP.1
N$13
  Bottom 0.406: ISP.3 43.18,32.38 43.24,32.33 IC1.17
N$15
  Bottom 0.406: C7.2 FRONTLED_R.1 R10.2
N$16
  Bottom 0.406: P-FET1.3 9.46,30.49 R14.1 R8.2
N$18
  Bottom 0.406: C13.2 46.89,33.02 46.35,33.02 45.64,32.3 IC1.20
N$20
  Bottom 0.406: R1.2 R2.1 5.82,30.58 6.03,30.8 6.03,32.09 P-FET2.3
N$21
  Bottom 0.406: R11.2 FRONTLED_G.1 C8.2
N$22
  Bottom 0.406: R12.2 FRONTLED_B.1 C9.2
N$23
  Bottom 0.406: C10.2 FRONTLED_W.1 R15.2
N$27
  Bottom 1.422: 45.4,11.11 L_PWR(O).1 41.54,15.02 U$3.OUT+
N$28
  Bottom 0.406: REV.2 31.63,11.15 | 23.52,11.11 ON.2 22.12,12.58 R9.1
  Bottom 1.422: 31.63,11.15 29.37,8.89 25.72,8.89 23.55,11.05 ON.2
N$34
  Bottom 0.406: R21.2 6.04,34.19 P-FET2.2
N$44
  Bottom 0.406: PI.4 13.97,48.9 46.35,48.9 46.99,48.26 46.99,42.55 DISPLAY.1
  Bottom 0.813: PI.4 PI.2 10.16,47.15 8.73,45.72 8.73,43.97 10.16,42.55 D1(O).C
N$45
  Bottom 0.813: R3(O).2 62.83,13.34 L_AMP(O).2
N$46
  Bottom 0.813: L_AMP(O).1 63.46,18.38 U$4.VCC
N$53
  Bottom 0.406: P-FET3.2 4.54,41.58 R24.2
N$55
  Bottom 0.406: P-FET3.3 5.65,38.89 R23.1 R22.2
ONOFF  (via drill 0.4)
  Top 0.406: v45.88,25.88 v43.34,25.88 35.56,18.1 v32.07,18.1 | v53.66,18.73 62.87,9.53 OFF_2.1
  Bottom 0.406: v45.88,25.88 47.47,25.88 48.84,24.5 IC1.32 51.44,23.4 51.44,22.07 52.23,21.27 53.02,21.27 53.55,20.74 R25.1 53.66,19.9 v53.66,18.73 | OK1.1 v32.07,18.1 | v43.34,25.88 43.34,26.04 42.47,26.91 IC1.12
ONOFF_2  (via drill 0.4)
  Top 0.406: ON_2.1 64.14,4.45 63.5,3.81 53.34,3.81 47.62,9.53 v21.91,9.53
  Bottom 0.406: 18.95,11.11 ON.1 | OK1.3 20.95,15.24 20.95,15.08 20.8,14.92 20.8,13.39 R9.2 18.99,11.9 ON.1 | v21.91,9.53 21.91,9.63 20.52,9.63 ON.1
RESET  (via drill 0.4)
  Top 0.406: v52.23,26.99 52.23,33.66 v50.01,35.88
  Bottom 0.406: ISP.5 48.63,36.2 R13.2 49,35.88 v50.01,35.88 | IC1.29 51.99,26.91 v52.23,26.99
RX  (via drill 0.4)
  Top 0.406: v37.94,34.29 40.48,31.75 49.21,31.75 51.44,29.53 v51.44,26.04 | U$1.OUT 27.98,33.62 29.69,31.91 v34.92,31.91
  Bottom 0.406: v34.92,31.91 36.35,31.91 37.94,33.5 v37.94,34.29 | v51.44,26.04 50.4,26.04 IC1.30
SCL_BUS  (via drill 0.4)
  Top 0.406: v46.67,27.62 41.27,27.62 38.26,30.64 v31.75,30.64
  Bottom 0.406: v46.67,27.62 50.56,27.62 IC1.28 54.38,27.7 57.78,31.11 BUS1.P$4 58.16,32.12 D2.3 59.69,31.92 59.69,31.75 60.33,31.11 62.23,31.11 62.87,31.75 EXT_PORT.P$4 | R7.2 30.48,36.83 31.75,35.56 v31.75,30.64
SCL_PI  (via drill 0.4)
  Top 0.406: v27.15,36.99 26.35,37.78 15.24,37.78 11.43,41.59 11.43,45.72 12.06,46.35 14.61,46.35 15.24,45.72 PI.5
  Bottom 0.406: v27.15,36.99 28.2,36.99 R7.1
SDA_BUS  (via drill 0.4)
  Top 0.406: v46.04,28.57 41.27,28.57 v31.43,38.42
  Bottom 0.406: v46.04,28.57 46.11,28.5 IC1.27 53.91,28.5 54.61,29.21 54.61,31.75 57.15,34.29 BUS1.P$3 58.16,33.92 D2.4 59.69,34.12 59.69,34.29 60.33,34.92 62.23,34.92 62.87,34.29 EXT_PORT.P$3 | v31.43,38.42 30.38,38.42 R6.2
SDA_PI  (via drill 0.4)
  Top 0.406: v27.3,38.42 15.56,38.42 12.7,41.27 PI.3
  Bottom 0.406: v27.3,38.42 28.04,38.42 R6.1
TX  (via drill 0.4)
  Top 0.406: v49.05,25.4 47.15,23.5 44.13,23.5 43.18,22.54 43.18,18.41 41.91,17.14 v37.31,17.14 | v21.59,19.68 v14.76,26.51
  Bottom 0.406: R8.1 11.01,27.57 12.06,26.51 v14.76,26.51 | IC1.31 48.99,25.3 v49.05,25.4 | v37.31,17.14 34.29,17.14 31.75,19.68 v21.59,19.68

### Text on the board
tNames: GND | OUT_R- | 3.3V | GND | TSOP | MISO | RST | 5V | OUT_R+ | SCK | SDA | OUT_L+ | 1 | RX | 5V | GND | SCL | OUT_L- | PGND | 5V | Lasertag Weapon / v1.0 / warpzone.ms | BUTTON_1 | BUTTON_2 | BUTTON_3 | Audio AMP | IN_L | AGND | L_PWR | L_AMP | IN_R | XL6009 Step-Up
bNames: LDR_1 | LDR_2 | 10 | D1 | 5u | 5u | 5u | 5u | OUT_R- | 100 | 100n | 10k | 10k | 100 | OUT_R+ | 10 | 10 | 100n | 100n | 10k | OUT_L+ | 4R7 | 4R7 | 4R7 | 4R7 | 4R7 | 4R7 | 6R9 | 100n | OUT_L- | 10k | 10k | 100n | 10 | 10 | PGND | R20 | ATMEGA / 88PA / 168PA / 328PA | R19 | +5V | C1 | 470 | IN_L | 4u7 | 4u7 | 4u7 | 180k | 120k | AGND | 10k | IN_R | R3 | 3.3V | N-FET | N-FET | OFF_2 | OFF_1 | FUSE | C2 | ON_2 | ON_1